# EAGLE design circuit (EAGLE 9.6.0)
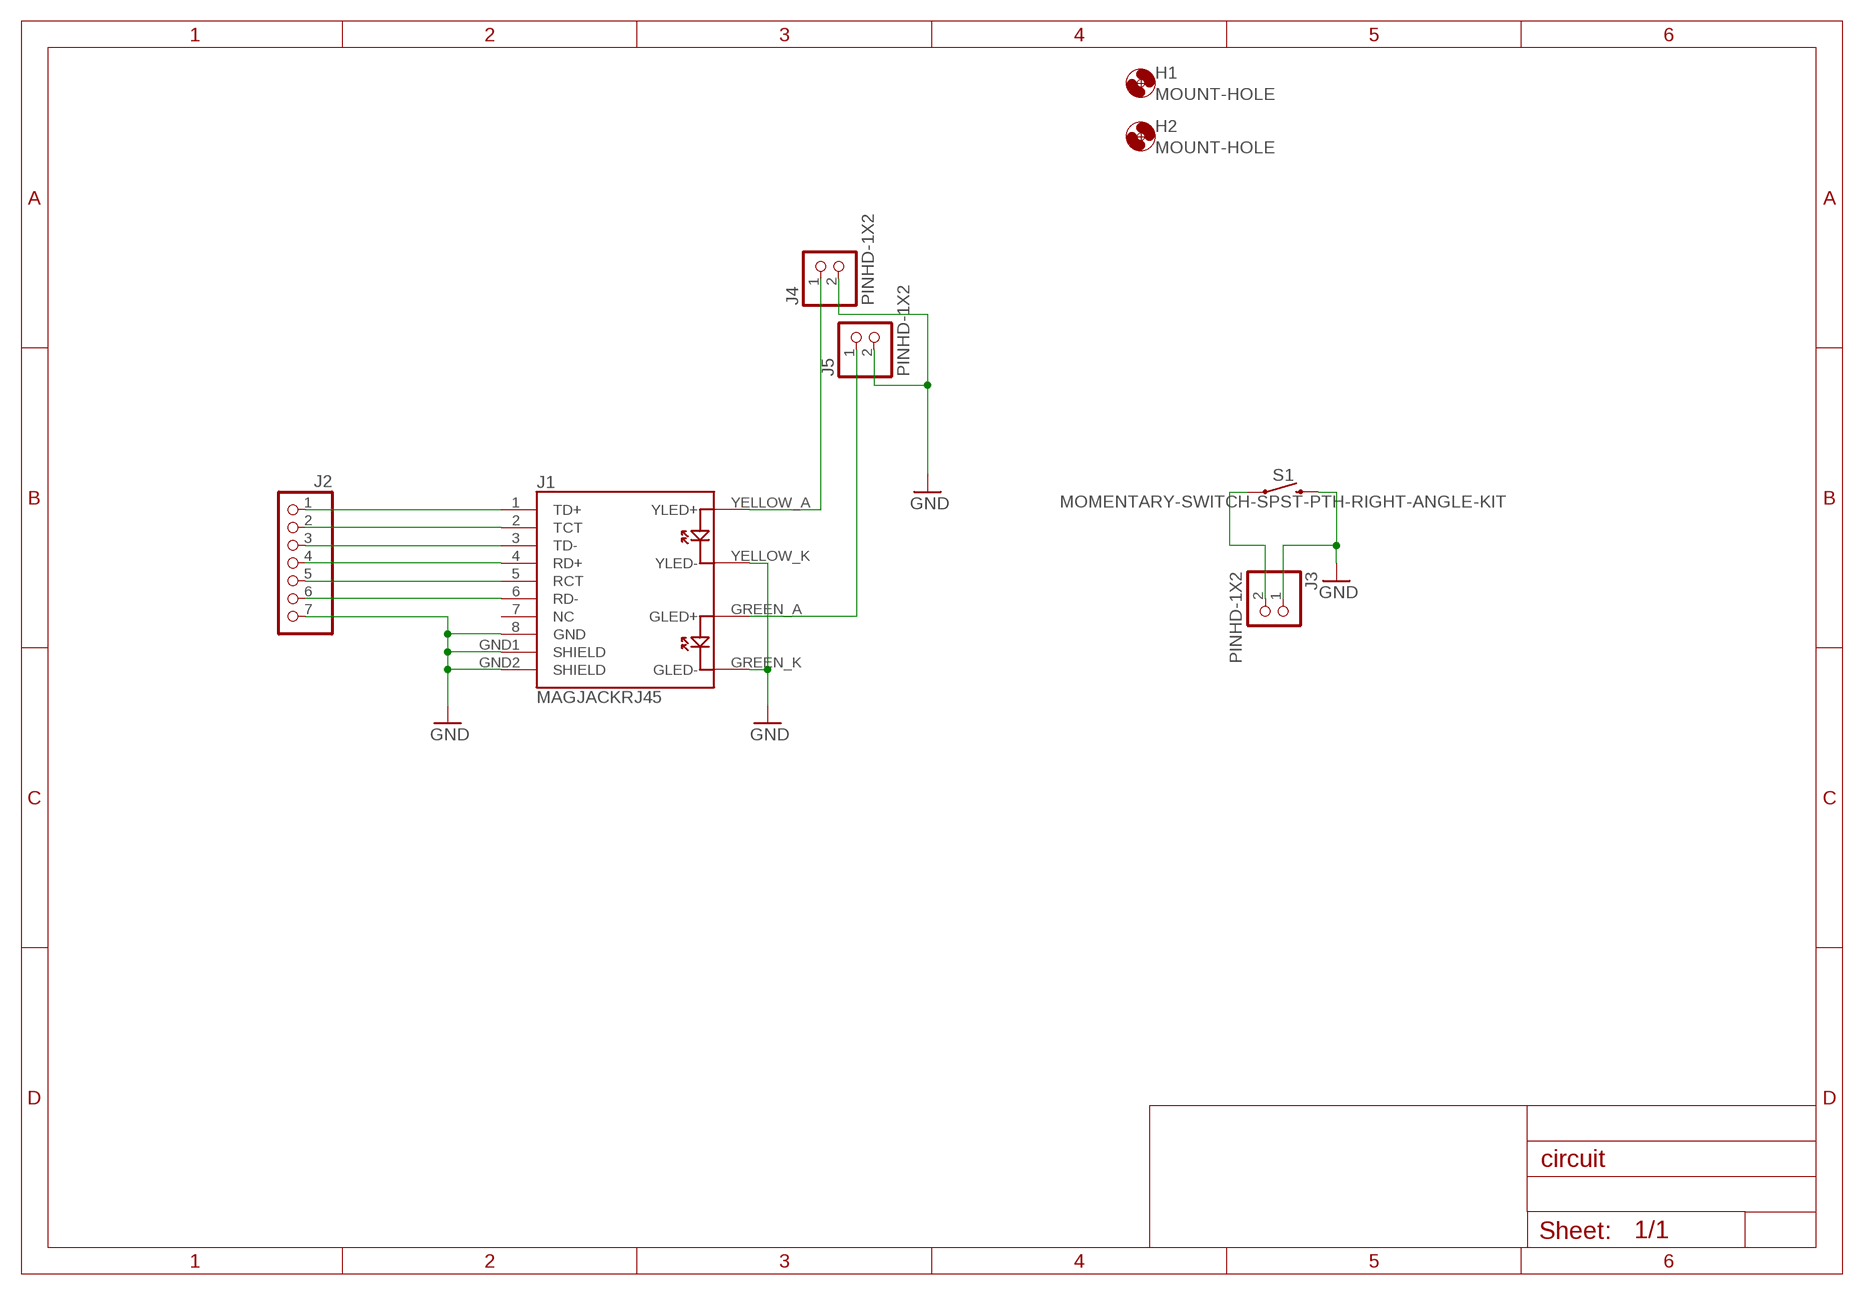
[diagram p0: schematic, sheet 1]

## Parts
H1  MOUNT-HOLE  [3,2]
H2  MOUNT-HOLE  [3,2]
J1  MAGJACKRJ45  [MAGJACK]
J2  PINHD-1X7  [1X07]
J3  PINHD-1X2  [1X02]
J4  PINHD-1X2  [1X02]
J5  PINHD-1X2  [1X02]
S1  MOMENTARY-SWITCH-SPST-PTH-RIGHT-ANGLE-KIT  [TACTILE_SWITCH_PTH_RIGHT_ANGLE_KIT]

## Nets
GND: J1.8(GND) J1.GND1(SHIELD) J1.GND2(SHIELD) J1.GREEN_K(GLED-) J1.YELLOW_K(YLED-) J2.7 J3.1 J4.2 J5.2 S1.2
N$1: J1.1(TD+) J2.1
N$2: J1.2(TCT) J2.2
N$3: J1.3(TD-) J2.3
N$4: J1.4(RD+) J2.4
N$5: J1.5(RCT) J2.5
N$6: J1.6(RD-) J2.6
N$7: J1.YELLOW_A(YLED+) J4.1
N$8: J1.GREEN_A(GLED+) J5.1
N$9: J3.2 S1.1
Unconnected: J1.7(NC)

## Library data of the parts
H1 H2 = THT:MOUNT-HOLE
J1 = THT:MAGJACK: MAGJACK: RJ-45 with LEDs This is a single port, RJ45 ethernet jacks with built in transformer (magnetics), status LEDs, and shielding. Here is the connector we sell at SparkFun: RJ45 Ethernet MagJack-Compatible <https://www.sparkfun.com/products/8534> (PRT-08534) Datasheet <http://www.sparkfun.com/datasheets/Prototyping/MagJack.pdf> It is used on this SparkFun product: SparkFun RJ45 MagJack Breakout <https://www.sparkfun.com/products/13021> (BOB-13021)
J2 = THT:PINHD-1X7: PIN HEADER
J3-J5 = THT:PINHD-1X2: PIN HEADER
S1 = THT:MOMENTARY-SWITCH-SPST: Momentary Switch (Pushbutton) - SPST Normally-open (NO) SPST momentary switches (buttons, pushbuttons). Variants PTH-12MM - 12mm square, through-hole Momentary Pushbutton Switch - 12mm Square <https://www.sparkfun.com/products/9190> (COM-09190) PTH-6.0MM, PTH-6.0MM-KIT - 6.0mm square, through-hole Mini Pushbutton Switch <https://www.sparkfun.com/products/97> (COM-00097) KIT package intended for soldering kit's - only one side of pads' copper is exposed. PTH-RIGHT-ANGLE-KIT - Right-angle, through-hole Right Angle Tactile Button <https://www.sparkfun.com/products/10791> - Used on SparkFun BigTime Watch Kit <https://www.sparkfun.com/products/11734> SMD-12MM - 12mm square, surface-mount Tactile Button - SMD (12mm) <https://www.sparkfun.com/products/12993> (COM-12993) Used on SparkFun PicoBoard <https://www.sparkfun.com/products/11888> SMD-4.5MM - 4.5mm Square Trackball Switch Used on SparkFun Blackberry Trackballer Breakout <https://www.sparkfun.com/products/13169> SMD-4.6MMX2.8MM - 4.60mm x 2.80mm, surface mount Used on SparkFun SAMD21 Mini Breakout <https://www.sparkfun.com/products/13664> SMD-5.2MM, SMD-5.2-REDUNDANT - 5.2mm square, surface-mount Mini Pushbutton Switch - SMD <https://www.sparkfun.com/products/8720> (COM-08720) Used on Arduino Pro Mini <https://www.sparkfun.com/products/11114> REDUNDANT package connects both switch circuits together SMD-6.0X3.5MM - 6.0 x 3.5mm, surface mount Momentary Reset Switch SMD <https://www.sparkfun.com/products/8229> (COM-08229) SMD-6.2MM-TALL - 6.2mm square, surface mount Tactile Button - SMD (6mm) <https://www.sparkfun.com/products/12992> Used on SparkFun Digital Sandbox <https://www.sparkfun.com/products/12651> SMD-RIGHT-ANGLE - Right-angle, surface mount Used on SparkFun Block for Intel® Edison - Arduino <https://www.sparkfun.com/products/13036>; PROD_ID: CONN-10672; SF_SKU: COM-10791

## Board
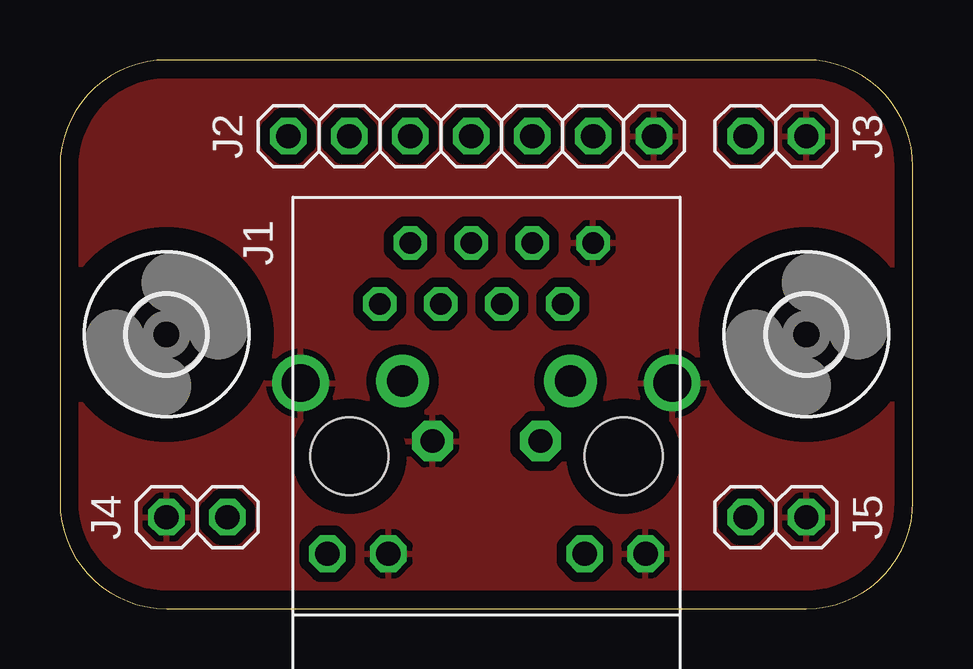
[diagram p1: board, top side]
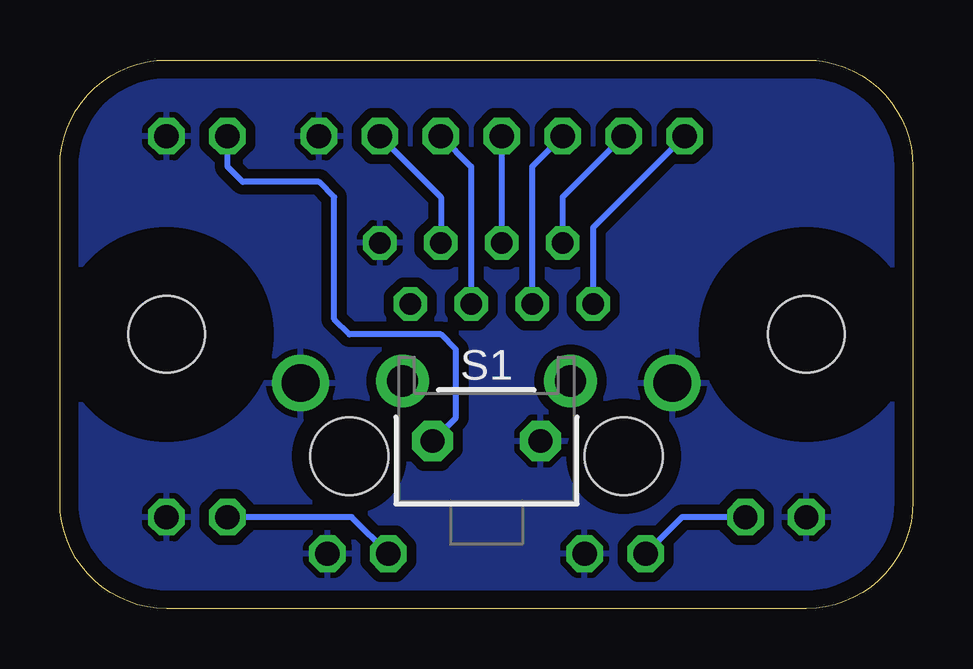
[diagram p2: board, bottom side, seen from below]

Size 35.56 x 22.86 mm. Coordinates in mm from the lower left corner, seen from the top.
Outline: 4.45,0 31.11,0 arc90 35.56,4.45 35.56,18.41 arc90 31.11,22.86 4.45,22.86 arc90 0,18.41 0,4.45 arc90 4.45,0
Copper layers (1*16): Top 0.035mm / dielectric 1.5mm / Bottom 0.035mm
Design rules "default *": minimum track width 6mil, minimum drill 0.35mm, track to track 6mil, track to pad 6mil, pad to pad 6mil, via to via 6mil, smd to smd 6mil, copper to edge 30mil, drill to drill 6mil, minimum pad ring 10mil, minimum via ring 8mil, stop-mask expansion 4mil, vias tented up to drill 0mil, thermal gap 10mil

### Footprints (pad centres in the part's own frame; a part is rotated, then mirrored left to right if it is on the bottom)
3,2 = hole 3.2: 0,0
MAGJACK = drill 0.889 octagon: 1 -4.445,6.35; 2 -3.175,8.89; 3 -1.905,6.35; 4 -0.635,8.89; 5 0.635,6.35; 6 1.905,8.89; 7 3.175,6.35; 8 4.445,8.89 | drill 1.575: GND1 -7.747,3.048; GND2 7.747,3.048 | drill 1.016 octagon: GREEN_A 4.089,-4.064; GREEN_K 6.629,-4.064; YELLOW_A -6.629,-4.064; YELLOW_K -4.089,-4.064 | hole 3.251: -5.715,0; 5.715,0
1X07 = drill 1.016 octagon: 1 -7.62,0; 2 -5.08,0; 3 -2.54,0; 4 0,0; 5 2.54,0; 6 5.08,0; 7 7.62,0
1X02 = drill 1.016 octagon: 1 -1.27,0; 2 1.27,0
TACTILE_SWITCH_PTH_RIGHT_ANGLE_KIT = drill 0.99 pad 1.7 octagon: 1 -2.248,0; 2 2.248,0 | drill 1.3 pad 2.2: ANCHOR1 -3.5,2.5; ANCHOR2 3.5,2.5

### Placement (x,y rotation side)
H1  4.45,11.43 0 top
H2  31.11,11.43 0 top
J1  17.78,6.35 0 top
J2  17.14,19.68 0 top
J3  29.84,19.68 180 top
J4  5.71,3.81 180 top
J5  29.84,3.81 0 top
S1  17.78,6.99 0 bottom

### Tracks (layer width: path | path; a pad name or v marks a point on that pad's centre or on a via)
GND
  pour Top (isolate 0.406): 0,4.45 0,18.41 arc-90 4.45,22.86 31.11,22.86 arc-90 35.56,18.41 35.56,4.45 arc-90 31.11,0 4.45,0 arc-90
  pour Bottom (isolate 0.406): 0,4.45 0,18.41 arc-90 4.45,22.86 31.11,22.86 arc-90 35.56,18.41 35.56,4.45 arc-90 31.11,0 4.45,0 arc-90
N$1
  Bottom 0.254: J2.1 13.34,15.88 J1.1
N$2
  Bottom 0.254: J2.2 14.61,17.14 J1.2
N$3
  Bottom 0.254: J2.3 15.88,18.41 J1.3
N$4
  Bottom 0.254: J2.4 J1.4
N$5
  Bottom 0.254: J2.5 18.41,18.41 J1.5
N$6
  Bottom 0.254: J2.6 19.68,17.14 J1.6
N$7
  Bottom 0.254: J4.1 9.63,3.81 J1.YELLOW_A
N$8
  Bottom 0.254: J1.GREEN_A 23.39,3.81 J5.1
N$9
  Bottom 0.254: J3.2 28.57,18.41 27.94,17.78 24.77,17.78 24.13,17.14 24.13,12.06 23.5,11.43 19.68,11.43 19.05,10.79 19.05,7.96 S1.1